# Altium project mojtaba paidar.PrjPcb
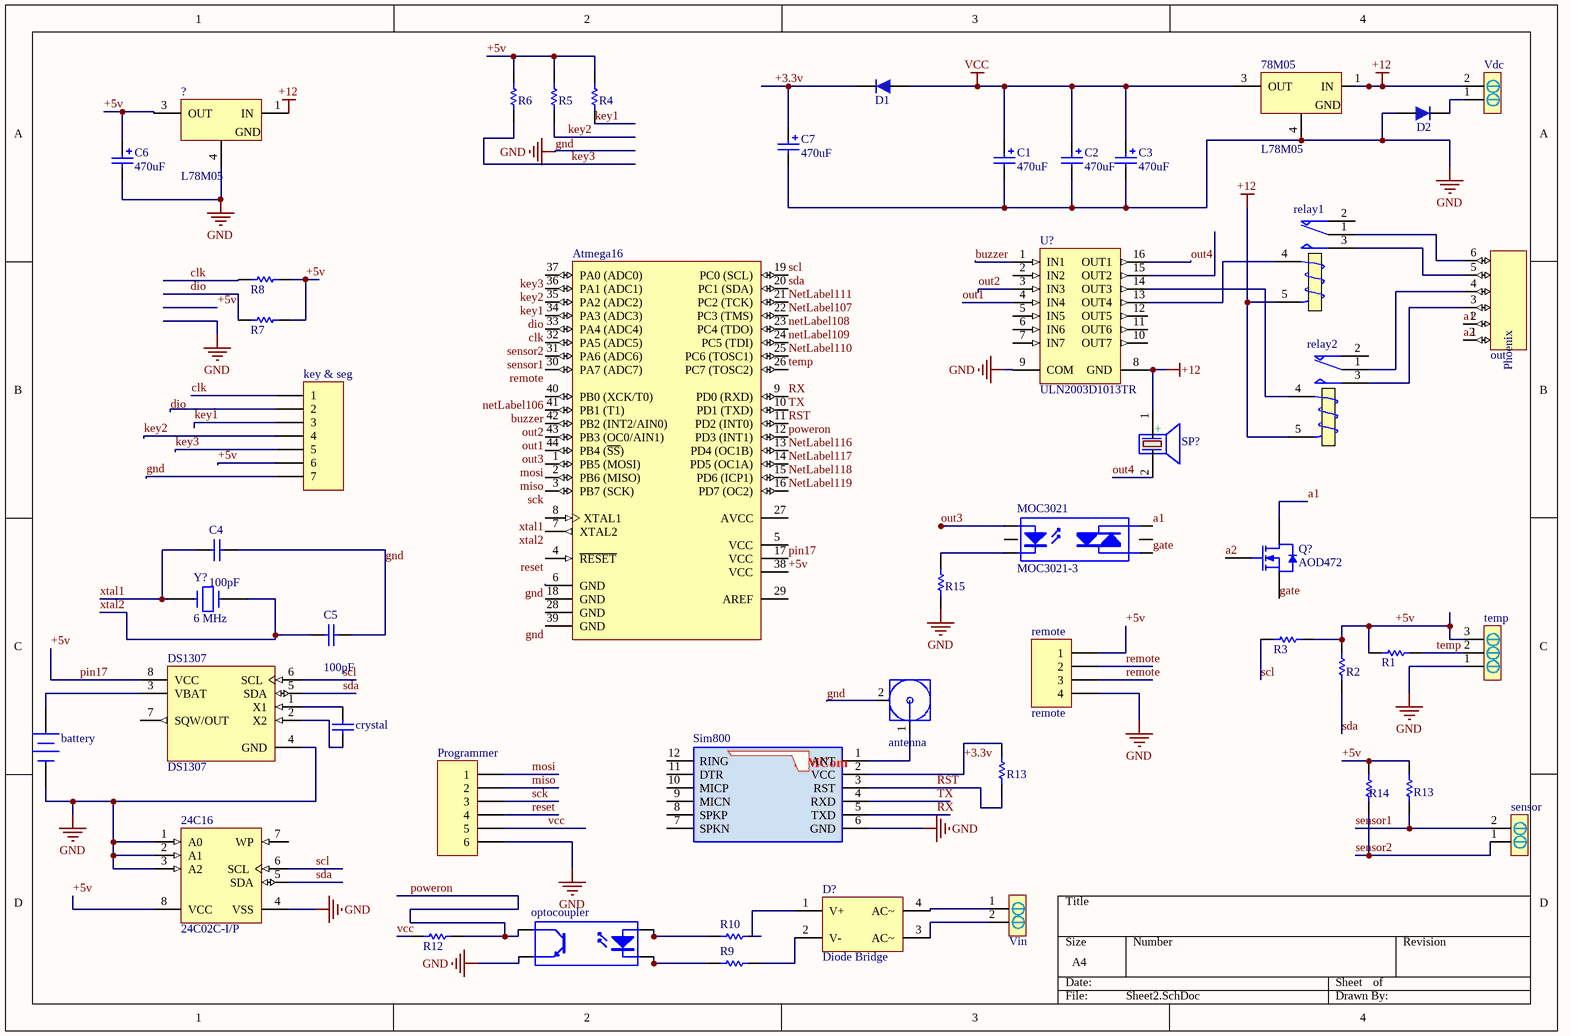
[diagram p0: Sheet2.SchDoc]
1 sheet, 50 parts. Net scope: global (net labels, ports and power ports of the same name join across sheets).
Board file: PCB2.PcbDoc

## Sheet Sheet2.SchDoc
size A4; SheetNumber: 1; SheetTotal: 1

### Parts
(Parts that share a designator on the sheet are numbered #1, #2 ... from top to bottom, then left to right.)
24C16  24C02C-I/P  [PDIP300-P8]
78M05  L78M05  [TO-252]
?  L78M05  [TO-252]
antenna  ANTENNA  [SMA-Right]  (value not drawn)
Atmega16  ATmega16-16AU  [44A_M]  (value not drawn)
battery  BATTERY 3V 1220  [BATT SMD]  (value not drawn)
C1  470uF  [CAP_POL5]
C2  470uF  [CAP_POL5]
C3  470uF  [CAP_POL5]
C4  value 100pF  [0805]  (hidden comment: C0805)
C5  value 100pF  [0805]  (hidden comment: C0805)
C6  470uF  [CAP_POL5]
C7  470uF  [CAP_POL5]
crystal  22pF  [XTAL-DT26]  (value not drawn)
D1  1n4007  [DIOM4629X24N]  (value not drawn)
D2  1n4007  [DIOM4629X24N]  (value not drawn)
D?  Diode Bridge  [MBF]
DS1307  DS1307  [DIP8]
key_&_seg  Header 7  [HDR1X7]  (value not drawn)
MOC3021  MOC3021-3  [DIP-6]
optocoupler  Optoisolator1  [DIP-4]  (value not drawn)
out  PHOENIX 6  [phonix 6]  (value not drawn)
Programmer  programmer  [HDR1X6]  (value not drawn)
Q?  AOD472  [TO252-3L]
R1  RES  [CC2012-0805]  (value not drawn)
R2  RES  [CC2012-0805]  (value not drawn)
R3  RES  [CC2012-0805]  (value not drawn)
R4  RES  [CC2012-0805]  (value not drawn)
R5  RES  [CC2012-0805]  (value not drawn)
R6  RES  [CC2012-0805]  (value not drawn)
R7  RES  [CC2012-0805]  (value not drawn)
R8  RES  [CC2012-0805]  (value not drawn)
R9  1K  [Axial 1W  7_0mm]  (value not drawn)
R10  1K  [Axial 1W  7_0mm]  (value not drawn)
R12  RES  [CC2012-0805]  (value not drawn)
R13#1  RES  [CC2012-0805]  (value not drawn)
R13#2  RES  [CC2012-0805]  (value not drawn)
R14  RES  [CC2012-0805]  (value not drawn)
R15  RES  [CC2012-0805]  (value not drawn)
relay1  (no value)  [Relay 18.85x15.35x15.70]
relay2  (no value)  [Relay 18.85x15.35x15.70]
remote  remote  [HDR1X4]
sensor  PHONIX2  [PHONIX2]  (value not drawn)
Sim800  SIM800L  [SIM800L_L250W236H60]  (value not drawn)
SP?  (no value)  [BUZZER 7.62mm DC]
temp  PHONIX3  [PHONIX3]  (value not drawn)
U?  ULN2003D1013TR  [STM-SO-16_M]
Vdc  PHONIX2  [PHONIX2]  (value not drawn)
Vin  PHONIX2  [PHONIX2]  (value not drawn)
Y?  6 MHz  [My_Crystal]

### Nets
+12: 78M05.1(IN) ?.1(IN) relay1.5(T2) relay2.5(T2) SP?.1(+) U?.8(GND) Vdc.2
gnd: 24C16.1(A0) 24C16.2(A1) 24C16.3(A2) 24C16.4(VSS) 78M05.4(GND) ?.4(GND) antenna.2(GND) Atmega16.6(GND) Atmega16.39(GND) battery.2(-) C1.2 C2.2 C3.2 C4.2 C5.2 C6.2 C7.2 D2.1 DS1307.4(GND) key_&_seg.7 optocoupler.3(E) Programmer.6 R15.1 remote.4 Sim800.6(GND) temp.1 U?.9(COM)
vcc: 78M05.3(OUT) C1.1 C2.1 C3.1 D1.1 Programmer.5 R12.2
+3.3v: C7.1 D1.2 R13#1.2 Sim800.2(VCC)
+5v: 24C16.8(VCC) ?.3(OUT) Atmega16.17(VCC) Atmega16.38(VCC) C6.1 DS1307.8(VCC) key_&_seg.6 R1.1 R2.2 R3.2 R4.2 R5.2 R6.2 R7.2 R8.2 R13#2.2 R14.2 remote.1 temp.3  [also labelled pin17]
a1: MOC3021.4(A/K) out.2 Q?.4(D)
a2: out.1 Q?.1(G)
buzzer: Atmega16.41(PB1_(T1)) U?.1(IN1)
clk: Atmega16.33(PA4_(ADC4)) key_&_seg.1 R8.1
dio: Atmega16.34(PA3_(ADC3)) key_&_seg.2 R7.1
gate: MOC3021.6(A/K) Q?.3(S)
key1: Atmega16.35(PA2_(ADC2)) key_&_seg.3 R4.1
key2: Atmega16.36(PA1_(ADC1)) key_&_seg.4 R5.1
key3: Atmega16.37(PA0_(ADC0)) key_&_seg.5 R6.1
miso: Atmega16.2(PB6_(MISO)) Programmer.2
mosi: Atmega16.1(PB5_(MOSI)) Programmer.1
netLabel106: Atmega16.40(PB0_(XCK/T0))
NetLabel107: Atmega16.22(PC3_(TMS))
netLabel108: Atmega16.23(PC4_(TDO))
netLabel109: Atmega16.24(PC5_(TDI))
NetLabel110: Atmega16.25(PC6_(TOSC1))
NetLabel111: Atmega16.21(PC2_(TCK))
NetLabel116: Atmega16.13(PD4_(OC1B))
NetLabel117: Atmega16.14(PD5_(OC1A))
NetLabel118: Atmega16.15(PD6_(ICP1))
NetLabel119: Atmega16.16(PD7_(OC2))
out1: Atmega16.43(PB3_(OC0/AIN1)) U?.4(IN4)
out2: Atmega16.42(PB2_(INT2/AIN0)) U?.3(IN3)
out3: Atmega16.44(PB4_(~{SS})) MOC3021.1(A)
out4: SP?.2(-) U?.16(OUT1)
poweron: Atmega16.12(PD3_(INT1)) optocoupler.4(C) R12.1
remote: Atmega16.30(PA7_(ADC7)) remote.2 remote.3
reset: Atmega16.4(~{RESET}) Programmer.4
RST: Atmega16.11(PD2_(INT0)) R13#1.1 Sim800.3(RST)
RX: Atmega16.9(PD0_(RXD)) Sim800.5(TXD)
sck: Atmega16.3(PB7_(SCK)) Programmer.3
scl: 24C16.6(SCL) Atmega16.19(PC0_(SCL)) DS1307.6(SCL) R3.1
sda: 24C16.5(SDA) Atmega16.20(PC1_(SDA)) DS1307.5(SDA) R2.1
sensor1: Atmega16.31(PA6_(ADC6)) R13#2.1 sensor.2
sensor2: Atmega16.32(PA5_(ADC5)) R14.1 sensor.1
temp: Atmega16.26(PC7_(TOSC2)) R1.2 temp.2
TX: Atmega16.10(PD1_(TXD)) Sim800.4(RXD)
xtal1: Atmega16.8(XTAL1) C4.1 Y?.1
xtal2: Atmega16.7(XTAL2) C5.1 Y?.2
Netantenna_1: antenna.1(ANT) Sim800.1(ANT)
Netbattery_1: battery.1(+) DS1307.3(VBAT)
Netcrystal_1: crystal.1 DS1307.1(X1)
Netcrystal_2: crystal.2 DS1307.2(X2)
NetD2_2: D2.2 Vdc.1
NetD?_1: D?.1(V+) R10.2
NetD?_2: D?.2(V-) R9.2
NetD?_3: D?.3(AC~) Vin.2
NetD?_4: D?.4(AC~) Vin.1
NetMOC3021_2: MOC3021.2(K) R15.2
Netoptocoupler_1: optocoupler.1(A) R10.1
Netoptocoupler_2: optocoupler.2(K) R9.1
Netout_3: out.3 relay2.3(NO)
Netout_4: out.4 relay2.1(COM)
Netout_5: out.5 relay1.3(NO)
Netout_6: out.6 relay1.1(COM)
Netrelay1_4: relay1.4(T1) U?.13(OUT4)
Netrelay2_4: relay2.4(T1) U?.14(OUT3)

Not connected (* = marked no-connect by the designer): 24C16 7(WP); Atmega16 5(VCC) 18(GND) 27(AVCC) 28(GND) 29(AREF); DS1307 7(SQW/OUT); MOC3021 3(NC) 5(NC); relay1 2(NC); relay2 2(NC); Sim800 7(SPKN) 8(SPKP) 9(MICN) 10(MICP) 11(DTR) 12(RING); U? 2(IN2) 5(IN5) 6(IN6) 7(IN7) 10(OUT7) 11(OUT6) 12(OUT5) 15(OUT2)

### Notes on the sheet
- (in symbol PHOENIX 6) Phoenix
- (in symbol SIM800L) SIMCom

### Library data of the parts
24C16 = CMP-0159-00018-1: 2Kbit, 400kHz, 5V, I2C Serial EEPROM, 8-Pin PDIP, Industrial Temperature; PackageDescription: 8-Lead Plastic Dual In-Line (P) - 300 mil Body [PDIP]; DatasheetVersion: revJ, Aug-2008; PackageReference: PDIP300-P8; PackageVersion: revBB, Aug-2009; Code_JEDEC: MS-001
78M05 ? = L78M05: Precision 500mA Regulator
Atmega16 = CMP-0095-00235-2: 8-bit AVR Microcontroller, 4.5-5.5V, 16KB Flash, 512 Bytes EEPROM, 1KB SRAM, 44-pin TQFP, Industrial Grade (-40°C to 85°C), Pb-Free; ComponentLink3URL: http://www.atmel.com/dyn/resources/prod_documents/2466S.pdf; ComponentLink1URL: http://www.atmel.com/; ComponentLink1Description: Manufacturer URL; Code_JEDEC: MS-026-ACB; ComponentLink2URL: http://www.atmel.com/dyn/resources/prod_documents/doc2466.pdf; DatasheetVersion: revT, Jul-2010; ComponentLink2Description: ATmega16(L)  Datasheet; PackageReference: 44A; PackageDescription: 44-Pin Plastic Thin Profile Quad Flat Pack, 10 x 10 x 1.0 mm Body, 0.8 mm Pitch (TQFP); RevisionNote: DatasheetVersion & PackageVersion updated. URLs added.; ComponentLink3Description: ATmega16(L) Summary; PackageVersion: revC, Oct-2010
C1-C3 C6 C7 = Cap Pol3: Polarized Capacitor (Surface Mount); Value: 100pF; Published: 8-Jun-2000; Revision: July-2002: Re-released for DXP Platform.; Publisher: Altium Limited
C4 C5 = C0805: Ceramic Chip Capacitor - Standard; Note: Footprint corresponds to dimensions for bulk cassette packaging. This case size has tightened tolerances.; Published: 17-Jul-2002; LatestRevisionDate: 19-Mar-2004; LatestRevisionNote: Silkscreen size reduced.; DatasheetDocument: Mar-2001; PackageDocument: Mar-2001; PackageReference: 0805; Publisher: Altium Limited; Code_JEITA: 0805; Code_IPC: 2012[0805]; ComponentLink1Description: Manufacturer Link; ComponentLink1URL: http://www.kemet.com/; ComponentLink2Description: Datasheet; ComponentLink2URL: http://www.kemet.com/kemet/web/homepage/kechome.nsf/vapubfilesname/F3102TA.pdf/$file/F3102TA.pdf
crystal = Cap Semi_1: Capacitor (Semiconductor SIM Model); Published: 8-Jun-2000; LatestRevisionDate: 29-May-2009; LatestRevisionNote: IPC-7351 Footprint Added.; PackageReference: C1206; Publisher: Altium Limited; PackageDescription: Chip Capacitor; Value: 22pF
D1 D2 = 1n4007 SMD M7: Standard Rectifiers; Part. No: M7; Manufacturer: DC COMPONENTS; Designer: Abbas Basereh; Link: http://www.tme.eu/en/details/m7/smd-universal-diodes/dc-components/; Link: https://www.aliexpress.com/item/Smd-tube-1n4007-m7-SMA/1213719741.html?spm=2114.01010208.3.1.ZyZ7bC&ws_ab_test=searchweb0_0,searchweb201602_4_10065_10068_10084_10083_10080_10082_10081_10060_10061_10062_10056_10055_10054_10059_10099_10078_10079_427_10073_10103_10102_10096_10052_10050_10051,searchweb201603_4&btsid=db2be5ca-e560-400a-b91c-484ab5ee228b; Data: 16-12-2016
DS1307 = DS1307: 64 X 8 Serial Real-Time Clock; Package Information: Latest Revision: 1999; Published: 13-Oct-2000; Revision: 17-Jul-2002: Re-released for DXP Platform.; Datasheet: Latest Revision: 10-Aug-1999; Package Reference: DIP8; Publisher: Altium Limited
key_&_seg = Header 7: Header, 7-Pin; LatestRevisionDate: 17-Jul-2002; LatestRevisionNote: Re-released for DXP Platform.; Publisher: Altium Limited
MOC3021 = MOC3021-3: Opto-Triac; Designer: Seyed Mohsen Ghasemian; E-mail: picpars@gmail.com; Published: 17-11-2011; LatestRevisionDate: 17-11-2011; Publisher: www.picpars.com; WEB: www.picpars.com
optocoupler = Optoisolator1: 4-Pin Phototransistor Optocoupler; Published: 24-Mar-1999; LatestRevisionDate: 04-Mar-2005; LatestRevisionNote: Sch pins 3 & 4 Swapped.; DatasheetVersion: Nov-2003; PackageReference: DIP-4; Publisher: Altium Limited
Programmer = Header 6: Header, 6-Pin; LatestRevisionDate: 17-Jul-2002; LatestRevisionNote: Re-released for DXP Platform.; Publisher: Altium Limited
Q? = AOD472: N-channel MOSFET; Note: Pin 2 is trimmed (and not drawn) and is electrically connected to Drain; Published: 2017-1-12; DatasheetVersion: 2017-1-12; PackageVersion: 2017-1-12; PackageReference: D-PAK TO-252; Publisher: Abbas Basereh; PackageDescription: D-PAK TO-252; ComponentLink1Description: Manufacturer Link; ComponentLink2Description: Datasheet; ComponentLink2URL: http://www.roboeq.ir/files/id/2912/name/aod472.pdf/
R1-R8 R12 R13#1 R13#2 R14 R15 = RES: Resistor; Published: 5-Jan-2004; DatasheetDocument: Nov-2002; Publisher: Altium Limited
R9 R10 = RES Axial 1W: Designer: Abbas Basereh; Desc.: RES Axial 1W; Data: 4-1-2017
relay1 relay2 = RELAY_SPDT: Single-Pole Dual-Throw Relay; Designer: Abbas Basereh; Mounting Technology: Through-Hole; ComponentLink1Description: Datasheet; Pin Count: 0; Update Date: 2017-3-1
remote = Header 4: Header, 4-Pin; LatestRevisionDate: 17-Jul-2002; LatestRevisionNote: Re-released for DXP Platform.; Publisher: Altium Limited
Sim800 = SIM800L: GSM/GPRS Module; Publisher: 3DFootprint.ir
SP? = PIEZO BUZZER: PIEZO BUZZER ACTIVE; Designer: Abbas Basereh; Comment_1: SPEAKER AND BEEP; Design Date: 1395/11/14; ComponentLink2Description: Reference; PackageDescription: THD; Publisher: Abbas Basereh; Mounting Technology: THD; Pin Count: 2; Status: Unreleased
U? = CMP-2000-05374-1: Seven NPN Darlington Array Transistor, 50 V, 500 mA, -40 to 85 degC, 8-Pin SOIC, RoHS, Tape and Reel; Manufacturer: STMicroelectronics; Collector Emitter Voltage V(br)ceo: 50V; SVHC: NoSVHC(17-Dec-2015); DC Current Gain hFE: 1000hFE; DC Collector Current: 500mA; No. of Pins: 16Pins; Package Reference: SO-16; Transistor Polarity: NPN; Transistor Case Style: SOIC; Datasheet URL: https://datasheet.ciiva.com/1193/1690348-1193460.pdf; Package Description: 16-Pin Small Outline Integrated Circuit, Body 9.9 x 3.9 mm, Pitch 1.27 mm; Datasheet Version: Rev. 8, 06/2012; Power Dissipation Pd: -; Product Range: -; Operating Temperature Max: 85degC; MSL: MSL1-Unlimited; Manufacturer URL: http://www.st.com/; Automotive Qualification Standard: -
Y? = CRYSTAL